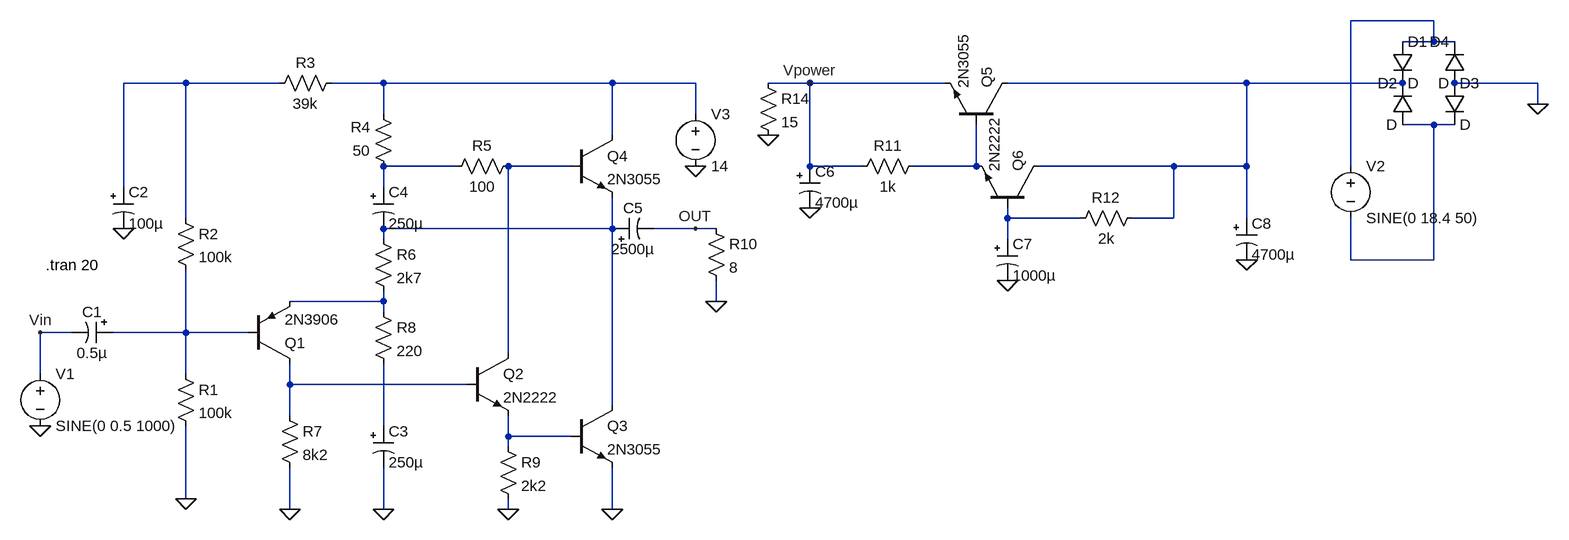
[diagram p0: schematic jlh1969.asc]
jlh1969.asc, the LTspice schematic file:
Version 4
SHEET 1 2224 792
WIRE 2048 -112 1920 -112
WIRE 2048 -80 2048 -112
WIRE 2048 -80 2000 -80
WIRE 2080 -80 2048 -80
WIRE 128 -16 32 -16
WIRE 272 -16 128 -16
WIRE 432 -16 352 -16
WIRE 784 -16 432 -16
WIRE 912 -16 784 -16
WIRE 1088 -16 1024 -16
WIRE 1296 -16 1088 -16
WIRE 1760 -16 1392 -16
WIRE 2000 -16 1760 -16
WIRE 2208 -16 2080 -16
WIRE 2208 16 2208 -16
WIRE 432 32 432 -16
WIRE 912 32 912 -16
WIRE 2048 48 2000 48
WIRE 2080 48 2048 48
WIRE 784 64 784 -16
WIRE 544 112 432 112
WIRE 720 112 624 112
WIRE 1088 112 1088 -16
WIRE 1168 112 1088 112
WIRE 1344 112 1344 48
WIRE 1344 112 1248 112
WIRE 1648 112 1440 112
WIRE 1760 112 1760 -16
WIRE 1760 112 1648 112
WIRE 1920 112 1920 -112
WIRE 32 144 32 -16
WIRE 432 144 432 112
WIRE 128 192 128 -16
WIRE 1392 192 1392 176
WIRE 1504 192 1392 192
WIRE 1648 192 1648 112
WIRE 1648 192 1584 192
WIRE 1760 192 1760 112
WIRE 784 208 784 160
WIRE 784 208 432 208
WIRE 912 208 848 208
WIRE 944 208 912 208
WIRE 432 224 432 208
WIRE 1392 224 1392 192
WIRE 1920 256 1920 192
WIRE 2048 256 2048 48
WIRE 2048 256 1920 256
WIRE 432 320 432 304
WIRE 432 320 288 320
WIRE 944 320 944 288
WIRE 432 336 432 320
WIRE -48 368 -96 368
WIRE 128 368 128 272
WIRE 128 368 16 368
WIRE 224 368 128 368
WIRE 624 400 624 112
WIRE -96 432 -96 368
WIRE 128 432 128 368
WIRE 288 448 288 416
WIRE 560 448 288 448
WIRE 784 480 784 208
WIRE 288 496 288 448
WIRE 432 512 432 416
WIRE 624 528 624 496
WIRE 720 528 624 528
WIRE 624 544 624 528
WIRE 128 624 128 512
WIRE 288 640 288 576
WIRE 432 640 432 576
WIRE 624 640 624 624
WIRE 784 640 784 576
FLAG 128 624 0
FLAG -96 512 0
FLAG 32 208 0
FLAG 288 640 0
FLAG 432 640 0
FLAG 624 640 0
FLAG 784 640 0
FLAG 944 320 0
FLAG 912 208 OUT
FLAG 1088 176 0
FLAG 2208 16 0
FLAG 1392 288 0
FLAG 1760 256 0
FLAG 1088 -16 Vpower
FLAG 912 112 0
FLAG -96 368 Vin
FLAG 1024 64 0
SYMBOL voltage -96 416 R0
SYMATTR InstName V1
SYMATTR Value SINE(0 0.5 1000)
SYMBOL polcap 16 352 R90
WINDOW 0 0 32 VBottom 2
WINDOW 3 32 32 VTop 2
SYMATTR InstName C1
SYMATTR Value 0.5µ
SYMBOL polcap 16 144 R0
SYMATTR InstName C2
SYMATTR Value 100µ
SYMBOL polcap 416 512 R0
SYMATTR InstName C3
SYMATTR Value 250µ
SYMBOL polcap 416 144 R0
SYMATTR InstName C4
SYMATTR Value 250µ
SYMBOL npn 560 400 R0
SYMATTR InstName Q2
SYMATTR Value 2N2222
SYMBOL npn 720 480 R0
SYMATTR InstName Q3
SYMATTR Value 2N3055
SYMBOL npn 720 64 R0
SYMATTR InstName Q4
SYMATTR Value 2N3055
SYMBOL Res 112 416 R0
SYMATTR InstName R1
SYMATTR Value 100k
SYMBOL Res 112 176 R0
SYMATTR InstName R2
SYMATTR Value 100k
SYMBOL Res 368 -32 R90
WINDOW 0 0 56 VBottom 2
WINDOW 3 32 56 VTop 2
SYMATTR InstName R3
SYMATTR Value 39k
SYMBOL Res 448 128 R180
WINDOW 0 36 76 Left 2
WINDOW 3 36 40 Left 2
SYMATTR InstName R4
SYMATTR Value 50
SYMBOL Res 528 128 R270
WINDOW 0 32 56 VTop 2
WINDOW 3 0 56 VBottom 2
SYMATTR InstName R5
SYMATTR Value 100
SYMBOL pnp 224 416 M180
SYMATTR InstName Q1
SYMATTR Value 2N3906
SYMBOL Res 416 208 R0
SYMATTR InstName R6
SYMATTR Value 2k7
SYMBOL Res 272 480 R0
SYMATTR InstName R7
SYMATTR Value 8k2
SYMBOL Res 416 320 R0
SYMATTR InstName R8
SYMATTR Value 220
SYMBOL Res 608 528 R0
SYMATTR InstName R9
SYMATTR Value 2k2
SYMBOL polcap 784 224 R270
WINDOW 0 32 32 VTop 2
WINDOW 3 0 32 VBottom 2
SYMATTR InstName C5
SYMATTR Value 2500µ
SYMBOL res 928 192 R0
SYMATTR InstName R10
SYMATTR Value 8
SYMBOL npn 1392 48 M270
SYMATTR InstName Q5
SYMATTR Value 2N3055
SYMBOL npn 1440 176 M270
SYMATTR InstName Q6
SYMATTR Value 2N2222
SYMBOL Res 1264 96 R90
WINDOW 0 0 56 VBottom 2
WINDOW 3 32 56 VTop 2
SYMATTR InstName R11
SYMATTR Value 1k
SYMBOL polcap 1072 112 R0
SYMATTR InstName C6
SYMATTR Value 4700µ
SYMBOL polcap 1376 224 R0
SYMATTR InstName C7
SYMATTR Value 1000µ
SYMBOL Res 1600 176 R90
WINDOW 0 0 56 VBottom 2
WINDOW 3 32 56 VTop 2
SYMATTR InstName R12
SYMATTR Value 2k
SYMBOL polcap 1744 192 R0
SYMATTR InstName C8
SYMATTR Value 4700µ
SYMBOL diode 1984 -80 R0
SYMATTR InstName D1
SYMBOL diode 2016 48 R180
WINDOW 0 24 64 Left 2
WINDOW 3 24 0 Left 2
SYMATTR InstName D2
SYMBOL diode 2064 -16 R0
SYMATTR InstName D3
SYMBOL diode 2096 -16 R180
WINDOW 0 24 64 Left 2
WINDOW 3 24 0 Left 2
SYMATTR InstName D4
SYMBOL voltage 1920 96 R0
SYMATTR InstName V2
SYMATTR Value SINE(0 18.4 50)
SYMBOL voltage 912 16 R0
SYMATTR InstName V3
SYMATTR Value 14
SYMBOL Res 1008 -32 R0
SYMATTR InstName R14
SYMATTR Value 15
TEXT -88 264 Left 2 !.tran 20

The netlist it stands for:
* jlh1969.asc
V1 Vin 0 SINE(0 0.5 1000)
C1 N012 Vin 0.5µ
C2 N002 0 100µ
C3 N014 0 250µ
C4 N006 N010 250µ
Q2 N007 N013 N015 0 2N2222
Q3 N010 N015 0 0 2N3055
Q4 N003 N007 N010 0 2N3055
R1 N012 0 100k
R2 N002 N012 100k
R3 N003 N002 39k
R4 N006 N003 50
R5 N006 N007 100
Q1 N013 N012 N011 0 2N3906
R6 N010 N011 2k7
R7 N013 0 8k2
R8 N011 N014 220
R9 N015 0 2k2
C5 N010 OUT 2500µ
R10 OUT 0 8
Q5 N004 N008 Vpower 0 2N3055
Q6 N004 N009 N008 0 2N2222
R11 N008 Vpower 1k
C6 Vpower 0 4700µ
C7 N009 0 1000µ
R12 N004 N009 2k
C8 N004 0 4700µ
D1 N001 N004 D
D2 N005 N004 D
D3 0 N005 D
D4 0 N001 D
V2 N001 N005 SINE(0 18.4 50)
V3 N003 0 14
R14 Vpower 0 15
.model D D
.lib standard.dio
.model NPN NPN
.model PNP PNP
.lib standard.bjt
.tran 20
.backanno
.end